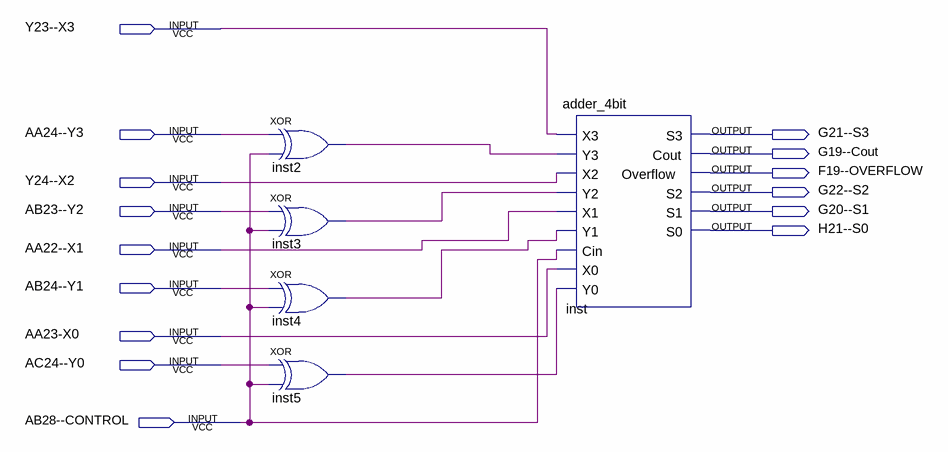
[diagram p0: schematic sheet]
// Quartus schematic add_sub.bdf as structural Verilog: 5 symbols, 15 pins
module add_sub (
  input  \Y23--X3 ,
  input  \AA24--Y3 ,
  input  \Y24--X2 ,
  input  \AB23--Y2 ,
  input  \AA22--X1 ,
  input  \AB24--Y1 ,
  input  \AA23-X0 ,
  input  \AC24--Y0 ,
  input  \AB28--CONTROL ,
  output \G21--S3 ,
  output \G19--Cout ,
  output \F19--OVERFLOW ,
  output \G22--S2 ,
  output \G20--S1 ,
  output \H21--S0 
);

  wire inst2_out, inst3_out, inst4_out, inst5_out;

  xor inst2 (inst2_out, \AA24--Y3 , \AB28--CONTROL );
  xor inst3 (inst3_out, \AB23--Y2 , \AB28--CONTROL );
  xor inst4 (inst4_out, \AB24--Y1 , \AB28--CONTROL );
  xor inst5 (inst5_out, \AC24--Y0 , \AB28--CONTROL );
  adder_4bit inst (
    .X3(\Y23--X3 ), .Y3(inst2_out), .X2(\Y24--X2 ), .Y2(inst3_out), .X1(\AA22--X1 ), .Y1(inst4_out),
    .Cin(\AB28--CONTROL ), .X0(\AA23-X0 ), .Y0(inst5_out), .S3(\G21--S3 ), .Cout(\G19--Cout ),
    .Overflow(\F19--OVERFLOW ), .S2(\G22--S2 ), .S1(\G20--S1 ), .S0(\H21--S0 ));
endmodule
